# EAGLE design lanpilot (EAGLE 5.06)
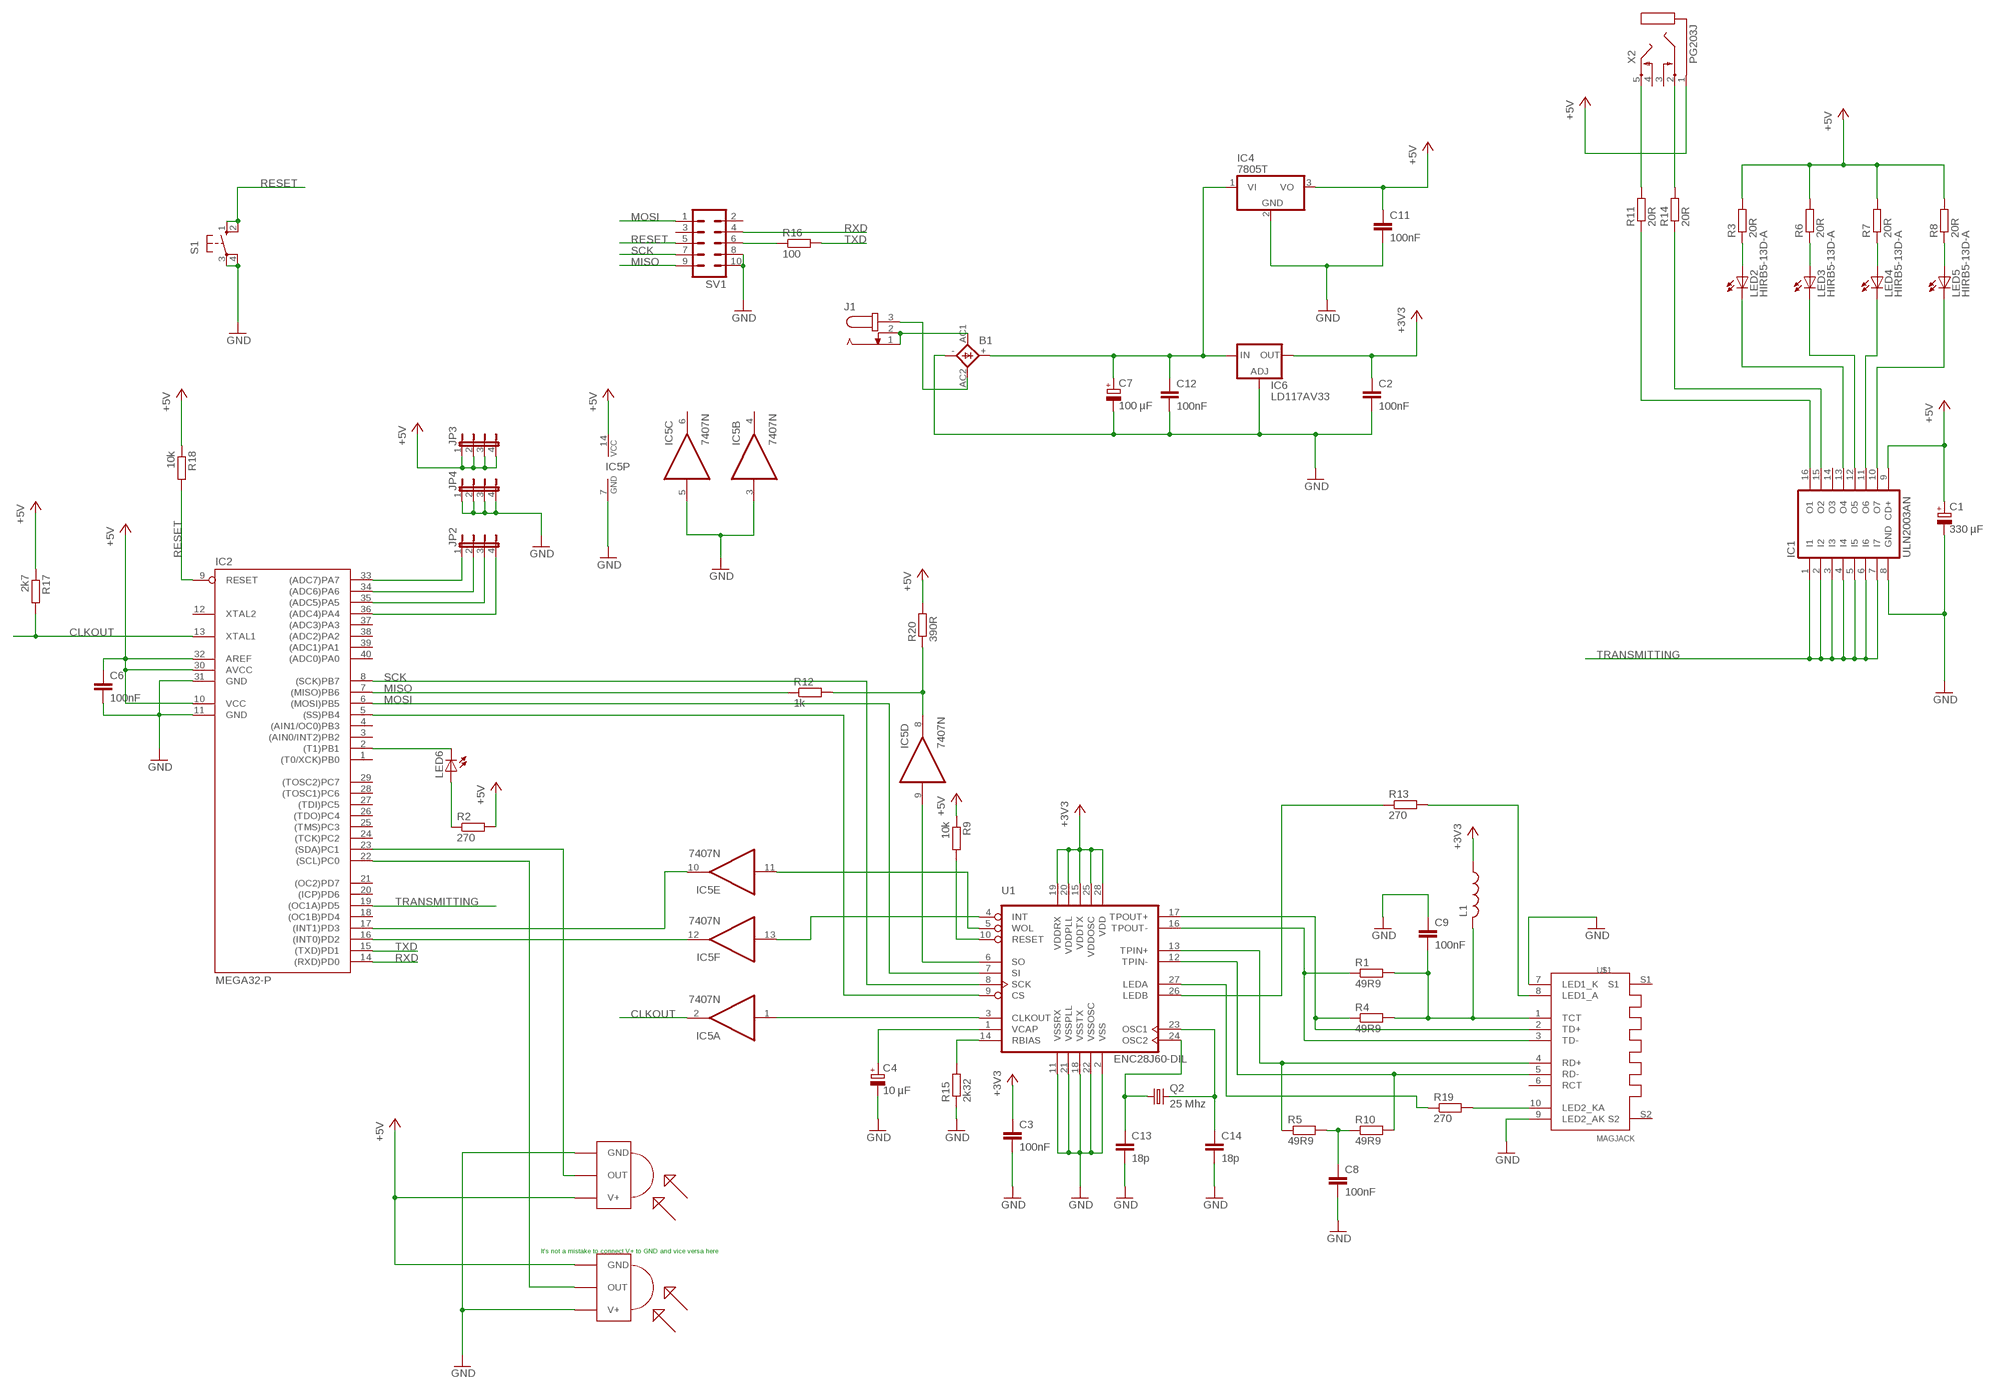
[diagram p0: schematic, sheet 1]

## Parts
B1  1KAB  [1KAB]
C1  330 µF  CPOL-EUE5-10.5  [E5-10,5]
C2  100nF  C-EU025-025X050  [C025-025X050]
C3  100nF  C-EU025-025X050  [C025-025X050]
C4  10 µF  CPOL-EUE5-5  [E5-5]
C6  100nF  C-EU025-025X050  [C025-025X050]
C7  100 µF  CPOL-EUE5-10.5  [E5-10,5]
C8  100nF  C-EU025-025X050  [C025-025X050]
C9  100nF  C-EU025-025X050  [C025-025X050]
C11  100nF  C-EU025-025X050  [C025-025X050]
C12  100nF  C-EU025-025X050  [C025-025X050]
C13  18p  C-EU025-030X050  [C025-030X050]
C14  18p  C-EU025-030X050  [C025-030X050]
IC1  ULN2003AN  [DIL16]
IC2  MEGA32-P  [DIL40]
IC4  7805T  [TO220H]
IC5  7407N  [DIL14]
IC6  LD117AV33  [TO220L1]
J1  JACK-PLUG1  [SPC4078]
JP2  JP4E  [JP4]
JP3  JP4E  [JP4]
JP4  JP4E  [JP4]
L1  L-US0204/7  [0204/7@1]
LED2  HIRB5-13D-A  LED5MM  [LED5MM]
LED3  HIRB5-13D-A  LED5MM  [LED5MM]
LED4  HIRB5-13D-A  LED5MM  [LED5MM]
LED5  HIRB5-13D-A  LED5MM  [LED5MM]
LED6  LED5MM  [LED5MM]
Q2  25 Mhz  CRYSTALHC49U70  [HC49U70]
R1  49R9  R-EU_MELF0102W  [MINI_MELF-0102W]
R2  270  R-EU_0207/10  [0207/10]
R3  20R  R-EU_0207/10  [0207/10]
R4  49R9  R-EU_MELF0102W  [MINI_MELF-0102W]
R5  49R9  R-EU_MELF0102W  [MINI_MELF-0102W]
R6  20R  R-EU_0207/10  [0207/10]
R7  20R  R-EU_0207/10  [0207/10]
R8  20R  R-EU_0207/10  [0207/10]
R9  10k  R-EU_0207/10  [0207/10]
R10  49R9  R-EU_MELF0102W  [MINI_MELF-0102W]
R11  20R  R-EU_0207/10  [0207/10]
R12  1k  R-EU_0207/7  [0207/7]
R13  270  R-EU_0207/15  [0207/15]
R14  20R  R-EU_0207/10  [0207/10]
R15  2k32  R-EU_0207/7  [0207/7]
R16  100  R-EU_0207/10  [0207/10]
R17  2k7  R-EU_0207/10  [0207/10]
R18  10k  R-EU_0207/10  [0207/10]
R19  270  R-EU_0207/7  [0207/7]
R20  390R  R-EU_0207/15  [0207/15]
S1  10-XX  [B3F-10XX]
SV1  ML10  [ML10]
TSOP1738  TSOP1738  [TSOP17XX]
TSOP32156  TSOP4838  [TSOP18XX]
U1  ENC28J60-DIL  [DIL28-3]
U$1  MAGJACK  [08B0-1X1T-06-F]
X2  PG203J  [PG203J]

## Nets
+3V3: C2.1 C3.1 IC6.2(OUT) L1.1 U1.15(VDDTX) U1.19(VDDRX) U1.20(VDDPLL) U1.25(VDDOSC) U1.28(VDD)
+5V: C1.+ C6.1 C11.1 IC1.9(CD+) IC2.10(VCC) IC2.30(AVCC) IC2.32(AREF) IC4.3(VO) IC5.14(P:VCC) JP3.1 JP3.2 JP3.3 JP3.4 R2.2 R3.2 R6.2 R7.2 R8.2 R9.1 R17.1 R18.1 R20.2 TSOP1738.V+ TSOP32156.GND X2.1
CLKOUT: IC2.13(XTAL1) IC5.2(A:O) R17.2
GND: B1.- C1.- C2.2 C3.2 C4.- C6.2 C7.- C8.2 C9.1 C11.2 C12.2 C13.2 C14.2 IC1.8(GND) IC2.11(GND) IC2.31(GND) IC4.2(GND) IC5.3(B:I) IC5.5(C:I) IC5.7(P:GND) IC6.1(ADJ) JP4.1 JP4.2 JP4.3 JP4.4 R15.1 S1.3(P) S1.4(P1) SV1.8 SV1.10 TSOP1738.GND TSOP32156.VCC(V+) U1.2(VSS) U1.11(VSSRX) U1.18(VSSTX) U1.21(VSSPLL) U1.22(VSSOSC) U$1.7(LED1_K) U$1.9(LED2_AK)
MISO: IC2.7((MISO)PB6) R12.1 SV1.9
MOSI: IC2.6((MOSI)PB5) SV1.1 U1.7(SI)
N$1: IC2.2((T1)PB1) LED6.K(C)
N$2: C13.1 Q2.1 U1.24(OSC2)
N$3: IC2.23((SDA)PC1) TSOP1738.OUT
N$4: C8.1 R5.2 R10.1
N$5: R5.1 U1.13(TPIN+) U$1.4(RD+)
N$6: R1.1 U1.16(TPOUT-) U$1.3(TD-)
N$7: R13.1 U1.26(LEDB)
N$8: C9.2 L1.2 R1.2 R4.2 U$1.1(TCT)
N$9: R13.2 U$1.8(LED1_A)
N$10: C14.1 Q2.2 U1.23(OSC1)
N$11: R15.2 U1.14(RBIAS)
N$12: C4.+ U1.1(VCAP)
N$13: R4.1 U1.17(TPOUT+) U$1.2(TD+)
N$14: IC2.33((ADC7)PA7) JP2.1
N$15: R14.2 X2.2
N$16: IC1.16(O1) R11.1
N$17: R10.2 U1.12(TPIN-) U$1.5(RD-)
N$18: IC5.9(D:I) U1.6(SO)
N$19: R19.2 U$1.10(LED2_KA)
N$20: R16.1 SV1.6
N$21: IC5.8(D:O) R12.2 R20.1
N$22: R19.1 U1.27(LEDA)
N$23: IC1.10(O7) LED5.K(C)
N$24: LED6.A R2.1
N$25: IC1.11(O6) LED4.K(C)
N$26: IC2.22((SCL)PC0) TSOP32156.OUT
N$27: IC1.12(O5) LED3.K(C)
N$28: IC1.13(O4) LED2.K(C)
N$29: B1.+ C7.+ C12.1 IC4.1(VI) IC6.3(IN)
N$30: IC2.5((SS)PB4) U1.9(CS)
N$31: R11.2 X2.5
N$32: LED2.A R3.1
N$33: LED3.A R6.1
N$34: LED4.A R7.1
N$35: LED5.A R8.1
N$38: IC2.17((INT1)PD3) IC5.10(E:O)
N$40: R9.2 U1.10(RESET)
N$41: IC5.11(E:I) U1.5(WOL)
N$42: IC2.34((ADC6)PA6) JP2.2
N$43: IC2.35((ADC5)PA5) JP2.3
N$44: IC2.36((ADC4)PA4) JP2.4
N$45: IC2.16((INT0)PD2) IC5.12(F:O)
N$46: IC5.13(F:I) U1.4(INT)
N$48: IC5.1(A:I) U1.3(CLKOUT)
N$50: B1.AC2 J1.3
N$52: B1.AC1 J1.1 J1.2
REMOTE_OUTPUT: IC1.15(O2) R14.1
RESET: IC2.9(RESET) R18.2 S1.1(S) S1.2(S1) SV1.5
RXD: IC2.14((RXD)PD0) SV1.4
SCK: IC2.8((SCK)PB7) SV1.7 U1.8(SCK)
TRANSMITTING: IC1.1(I1) IC1.2(I2) IC1.3(I3) IC1.4(I4) IC1.5(I5) IC1.6(I6) IC1.7(I7) IC2.19((OC1A)PD5)
TXD: IC2.15((TXD)PD1) R16.2
Unconnected: IC1.14(O3) IC2.1((T0/XCK)PB0) IC2.3((AIN0/INT2)PB2) IC2.4((AIN1/OC0)PB3) IC2.12(XTAL2) IC2.18((OC1B)PD4) IC2.20((ICP)PD6) IC2.21((OC2)PD7) IC2.24((TCK)PC2) IC2.25((TMS)PC3) IC2.26((TDO)PC4) IC2.27((TDI)PC5) IC2.28((TOSC1)PC6) IC2.29((TOSC2)PC7) IC2.37((ADC3)PA3) IC2.38((ADC2)PA2) IC2.39((ADC1)PA1) IC2.40((ADC0)PA0) IC5.4(B:O) IC5.6(C:O) SV1.2 SV1.3 U$1.6(RCT) U$1.S1 U$1.S2 X2.3 X2.4

## Notes on the sheet
- It's not a mistake to connect V+ to GND and vice versa here

## Library data of the parts
B1 = rectifier:1KAB: RECTIFIER grid 5,08 x 5,08 mm
C1 C4 C7 = rcl:CPOL-EU: POLARIZED CAPACITOR, European symbol
C2 C3 C6 C8 C9 C11-C14 = rcl:C-EU: CAPACITOR, European symbol
IC1 = uln-udn:ULN2003A: DRIVER ARRAY
IC2 = atmel:MEGA32-P: MICROCONTROLLER 32 Kbytes FLASH 2 Kbytes SRAM 1 Kbytes EEPROM USART 8-channel 10 bit ADC Source: www.atmel.com .. doc2503.pdf
IC4 = linear:78*: Positive VOLTAGE REGULATOR Source: http://cache.national.com/ds/LM/LM78L05.pdf http://www.fairchildsemi.com/ds/LM/LM7805.pdf
IC5 = 74xx-eu:74*07: Hex BUFFER, open collector high-voltage output
IC6 = v-reg:LD117A?*: Low drop fixed and adjustable positive voltage regulators 1 A Source: http://www.st.com/stonline/products/literature/ds/7194/ld1117axx.pdf
J1 = con-jack:JACK-PLUG: DC POWER JACK Power Jack, DC, Right Angle, Through Hole, Rated 5A at 16VDC, PC Terminals Distributor: Farnell (www.Farnell.de) Drawing: 84N1161.pdf / 84N1162.pdf Manufacturer: SPC Technology (www.spctechnology.com) Type: SPC4077 / SPC 4078
JP2-JP4 = jumper:JP4E: JUMPER
L1 = rcl:L-US: INDUCTOR, American symbol
LED2-LED6 = led:LED: LED OSRAM: - CHIPLED LG R971, LG N971, LY N971, LG Q971, LY Q971, LO R971, LY R971 LH N974, LH R974 LS Q976, LO Q976, LY Q976 LO Q996 - Hyper CHIPLED LW Q18S LB Q993, LB Q99A, LB R99A - SideLED LS A670, LO A670, LY A670, LG A670, LP A670 LB A673, LV A673, LT A673, LW A673 LH A674 LY A675 LS A676, LA A676, LO A676, LY A676, LW A676 LS A679, LY A679, LG A679 - Hyper Micro SIDELED® LS Y876, LA Y876, LO Y876, LY Y876 LT Y87S - SmartLED LW L88C, LW L88S LB L89C, LB L89S, LG L890 LS L89K, LO L89K, LY L89K LS L896, LA L896, LO L896, LY L896 - TOPLED LS T670, LO T670, LY T670, LG T670, LP T670 LSG T670, LSP T670, LSY T670, LOP T670, LYG T670 LG T671, LOG T671, LSG T671 LB T673, LV T673, LT T673, LW T673 LH T674 LS T676, LA T676, LO T676, LY T676, LB T676, LH T676, LSB T676, LW T676 LB T67C, LV T67C, LT T67C, LS T67K, LO T67K, LY T67K, LW E67C LS E67B, LA E67B, LO E67B, LY E67B, LB E67C, LV E67C, LT E67C LW T67C LS T679, LY T679, LG T679 LS T770, LO T770, LY T770, LG T770, LP T770 LB T773, LV T773, LT T773, LW T773 LH T774 LS E675, LA E675, LY E675, LS T675 LS T776, LA T776, LO T776, LY T776, LB T776 LHGB T686 LT T68C, LB T68C - Hyper Mini TOPLED® LB M676 - Mini TOPLED Santana® LG M470 LS M47K, LO M47K, LY M47K Source: http://www.osram.convergy.de LUXEON: - LUMILED® LXK2-PW12-R00, LXK2-PW12-S00, LXK2-PW14-U00, LXK2-PW14-V00 LXK2-PM12-R00, LXK2-PM12-S00, LXK2-PM14-U00 LXK2-PE12-Q00, LXK2-PE12-R00, LXK2-PE12-S00, LXK2-PE14-T00, LXK2-PE14-U00 LXK2-PB12-K00, LXK2-PB12-L00, LXK2-PB12-M00, LXK2-PB14-N00, LXK2-PB14-P00, LXK2-PB14-Q00 LXK2-PR12-L00, LXK2-PR12-M00, LXK2-PR14-Q00, LXK2-PR14-R00 LXK2-PD12-Q00, LXK2-PD12-R00, LXK2-PD12-S00 LXK2-PH12-R00, LXK2-PH12-S00 LXK2-PL12-P00, LXK2-PL12-Q00, LXK2-PL12-R00 Source: www.luxeon.com KINGBRIGHT: KA-3528ASYC Source: www.kingbright.com
Q2 = crystal:CRYSTAL: CRYSTAL
R1-R20 = rcl:R-EU_: RESISTOR, European symbol
S1 = switch-omron:10-XX: OMRON SWITCH
SV1 = con-harting-ml:ML10: HARTING
TSOP1738 = tsop:TSOP1738: IR Receiver and Demodulator
TSOP32156 = tsop:TSOP4838: IR Receiver and Demodulator
U1 = enc28j60:ENC28J60-*: Microchip 10Mbit Ethernet controller with SPI interface Improved SOIC28 layout (pads in 0.01 raster, pin1 slightly smaller). Pin 6 (SO) changed from Out (paralleling several Outs gives an error) to OC. Author: Profi from mikrocontroller.net - forum Date: 2006.0827
U$1 = magjack-2-freeware:MAGJACK: Magjack RJ45: 08B0-1X1T-06-F mcgregor@blackmesaeast.com.pl
X2 = con-hirschmann:PG203J: MIC/HEADPHONE JACK KS-S stereo microphone/headphone jack PG203JN (Schukat)

## Board
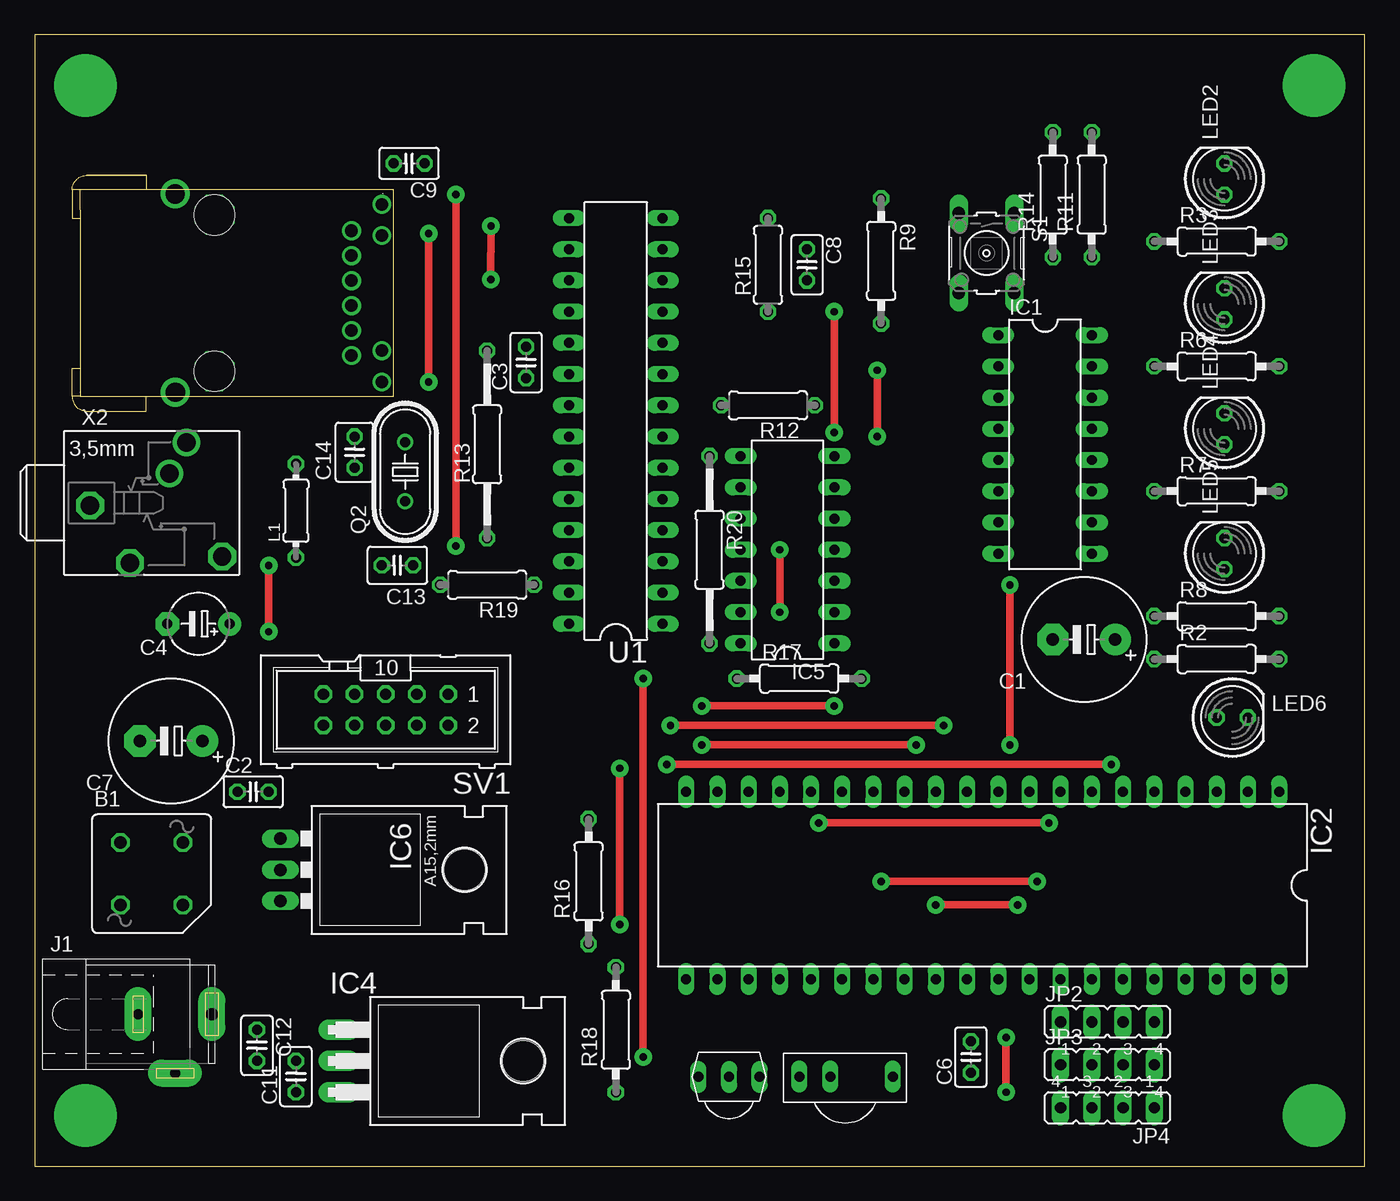
[diagram p1: board, top side]
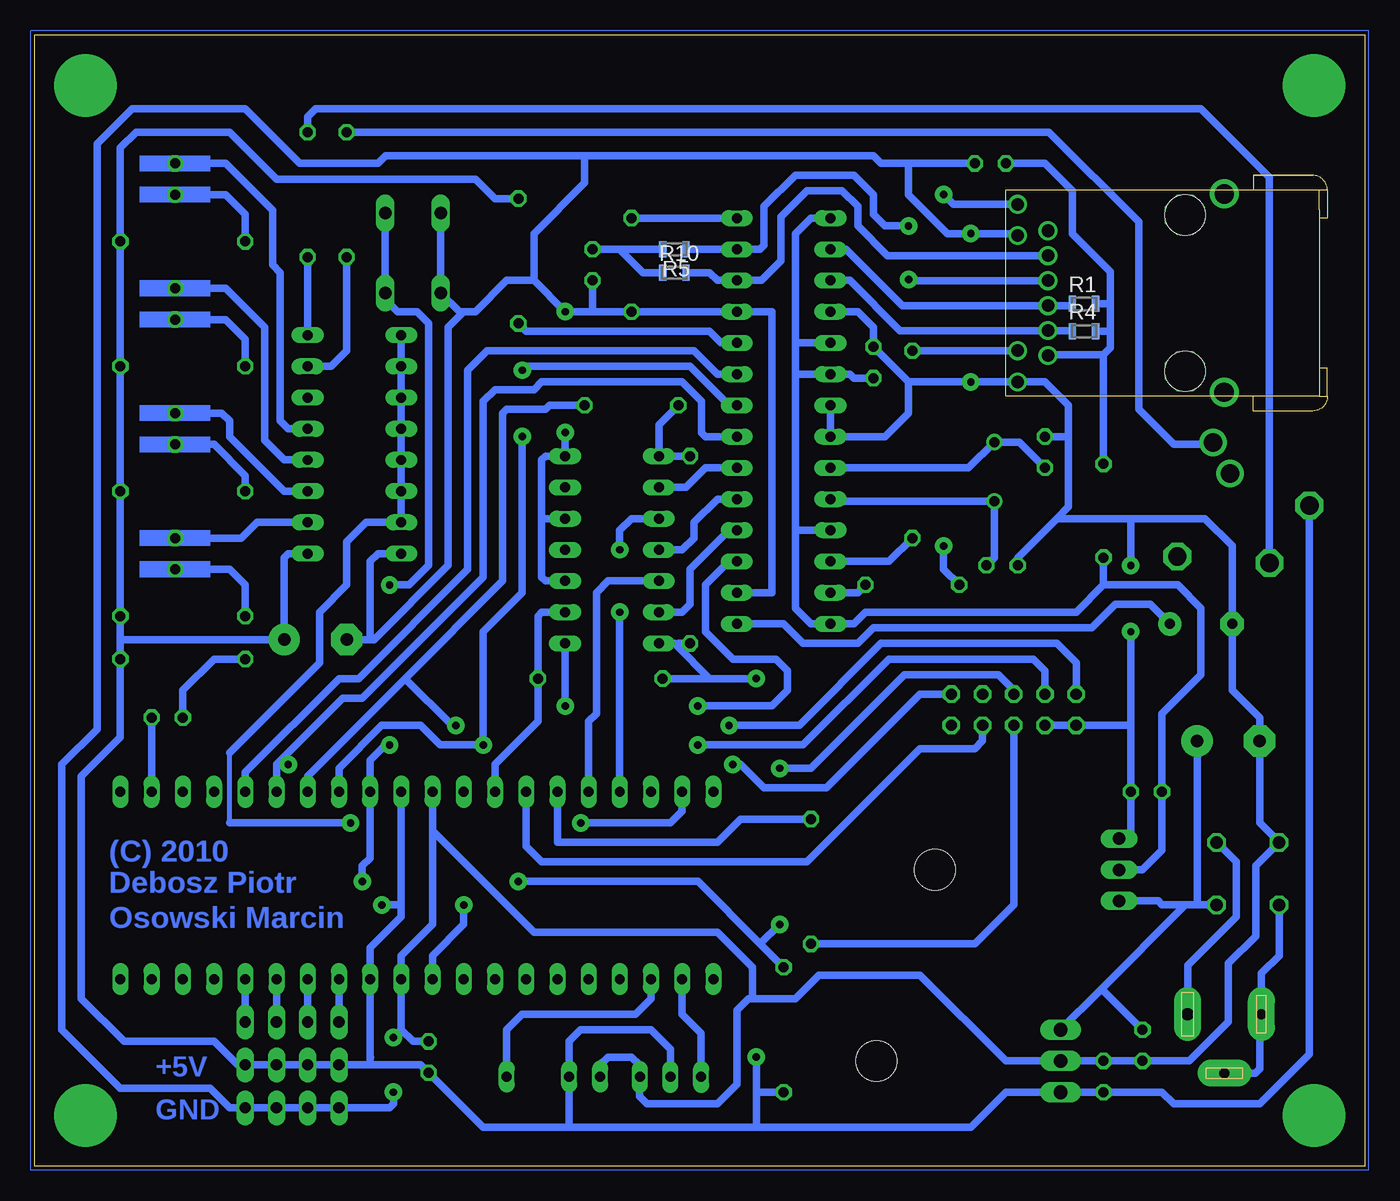
[diagram p2: board, bottom side, seen from below]

Size 108.25 x 92.06 mm. Coordinates in mm from the lower left corner, seen from the top.
Outline: 0,0 108.25,0 108.25,92.07 0,92.07 0,0
Copper layers (1*16): Top 0.035mm / dielectric 1.5mm / Bottom 0.035mm
Design rules "default *": minimum track width 10mil, minimum drill 12mil, track to track 8mil, track to pad 8mil, pad to pad 8mil, via to via 8mil, smd to smd 8mil, copper to edge 40mil, drill to drill 8mil, minimum pad ring 10mil, minimum via ring 8mil, stop-mask expansion 4mil, vias tented up to drill 0mil, thermal gap 10mil

### Footprints (pad centres in the part's own frame; a part is rotated, then mirrored left to right if it is on the bottom)
1KAB = drill 1.016 octagon: + 2.54,-2.54; - -2.54,2.54; AC1 -2.54,-2.54; AC2 2.54,2.54
E5-10,5 = drill 1.016 pad 2.54 round: + -2.54,0 | drill 1.016 pad 2.54 octagon: - 2.54,0
C025-025X050 = drill 0.813 octagon: 1 -1.27,0; 2 1.27,0
E5-5 = drill 0.813 pad 1.905 round: + -2.54,0 | drill 0.813 pad 1.905 octagon: - 2.54,0
C025-030X050 = drill 0.813 octagon: 1 -1.27,0; 2 1.27,0
DIL16 = drill 0.813 long: 1 -8.89,-3.81; 2 -6.35,-3.81; 3 -3.81,-3.81; 4 -1.27,-3.81; 5 1.27,-3.81; 6 3.81,-3.81; 7 6.35,-3.81; 8 8.89,-3.81; 9 8.89,3.81; 10 6.35,3.81; 11 3.81,3.81; 12 1.27,3.81; 13 -1.27,3.81; 14 -3.81,3.81; 15 -6.35,3.81; 16 -8.89,3.81
DIL40 = drill 0.813 long: 1 -24.13,-7.62; 2 -21.59,-7.62; 3 -19.05,-7.62; 4 -16.51,-7.62; 5 -13.97,-7.62; 6 -11.43,-7.62; 7 -8.89,-7.62; 8 -6.35,-7.62; 9 -3.81,-7.62; 10 -1.27,-7.62; 11 1.27,-7.62; 12 3.81,-7.62; 13 6.35,-7.62; 14 8.89,-7.62; 15 11.43,-7.62; 16 13.97,-7.62; 17 16.51,-7.62; 18 19.05,-7.62; 19 21.59,-7.62; 20 24.13,-7.62; 21 24.13,7.62; 22 21.59,7.62; 23 19.05,7.62; 24 16.51,7.62; 25 13.97,7.62; 26 11.43,7.62; 27 8.89,7.62; 28 6.35,7.62; 29 3.81,7.62; 30 1.27,7.62; 31 -1.27,7.62; 32 -3.81,7.62; 33 -6.35,7.62; 34 -8.89,7.62; 35 -11.43,7.62; 36 -13.97,7.62; 37 -16.51,7.62; 38 -19.05,7.62; 39 -21.59,7.62; 40 -24.13,7.62
TO220H = drill 1.118 long: 1 -2.54,-10.16; 2 0,-10.16; 3 2.54,-10.16 | hole 3.302: 0,4.826
DIL14 = drill 0.813 long: 1 -7.62,-3.81; 2 -5.08,-3.81; 3 -2.54,-3.81; 4 0,-3.81; 5 2.54,-3.81; 6 5.08,-3.81; 7 7.62,-3.81; 8 7.62,3.81; 9 5.08,3.81; 10 2.54,3.81; 11 0,3.81; 12 -2.54,3.81; 13 -5.08,3.81; 14 -7.62,3.81
TO220L1 = drill 1.016 long: 1 -2.54,-3.81; 2 0,-3.81; 3 2.54,-3.81 | hole 3.302: 0,11.176
SPC4078 = drill 0.8 pad 2.184 long: 1 -3,0; 2 0,-4.8 | drill 1 pad 2.184 long: 3 3,0
JP4 = drill 0.914 long: 1 -3.81,0; 2 -1.27,0; 3 1.27,0; 4 3.81,0
0204/7@1 = drill 0.813 octagon: 1 -3.81,0; 2 3.81,0
LED5MM = drill 0.813 octagon: A -1.27,0; K 1.27,0
HC49U70 = drill 0.813 round: 1 -2.413,0; 2 2.413,0
MINI_MELF-0102W = smd 0.6 x 1.3: 1 -0.95,0; 2 0.95,0
0207/10 = drill 0.813 octagon: 1 -5.08,0; 2 5.08,0
0207/7 = drill 0.813 octagon: 1 -3.81,0; 2 3.81,0
0207/15 = drill 0.813 octagon: 1 -7.62,0; 2 7.62,0
B3F-10XX = drill 1.016 long: 1 -3.251,2.261; 2 3.251,2.261; 3 -3.251,-2.261; 4 3.251,-2.261
ML10 = drill 0.914 octagon: 1 -5.08,-1.27; 2 -5.08,1.27; 3 -2.54,-1.27; 4 -2.54,1.27; 5 0,-1.27; 6 0,1.27; 7 2.54,-1.27; 8 2.54,1.27; 9 5.08,-1.27; 10 5.08,1.27
TSOP17XX = drill 0.813 long: GND -3.81,0; OUT 3.81,0; V+ -1.27,0
TSOP18XX = drill 0.813 long: GND -0.001,-0.027; OUT -2.501,-0.027; VCC 2.499,-0.027
DIL28-3 = drill 0.813 long: 1 -16.51,-3.81; 2 -13.97,-3.81; 3 -11.43,-3.81; 4 -8.89,-3.81; 5 -6.35,-3.81; 6 -3.81,-3.81; 7 -1.27,-3.81; 8 1.27,-3.81; 9 3.81,-3.81; 10 6.35,-3.81; 11 8.89,-3.81; 12 11.43,-3.81; 13 13.97,-3.81; 14 16.51,-3.81; 15 16.51,3.81; 16 13.97,3.81; 17 11.43,3.81; 18 8.89,3.81; 19 6.35,3.81; 20 3.81,3.81; 21 1.27,3.81; 22 -1.27,3.81; 23 -3.81,3.81; 24 -6.35,3.81; 25 -8.89,3.81; 26 -11.43,3.81; 27 -13.97,3.81; 28 -16.51,3.81
08B0-1X1T-06-F = drill 1.02 round: 1 2.15,2.46; 2 4.18,2.46; 3 6.21,2.46; 4 8.24,2.46; 5 10.27,2.46; 6 12.3,2.46; 7 0,0; 8 2.54,0; 9 11.91,0; 10 14.45,0 | drill 1.57 round: S1 -0.83,16.808; S2 15.3,16.809 | hole 3.25: 0.88,13.63; 13.58,13.63
PG203J = drill 1.499 octagon: 1 -5.004,-0.203; 4 5.74,-4.369; 5 -1.753,-4.902 | drill 1.499 round: 2 2.845,4.902; 3 1.448,2.388

### Placement (x,y rotation side)
B1  9.53,23.81 0 top
C1  85.41,42.86 180 top
C2  17.78,30.48 0 top
C3  40.01,65.41 90 top
C4  13.34,44.13 180 top
C6  76.2,8.89 90 top
C7  11.11,34.61 180 top
C8  62.87,73.34 270 top
C9  30.48,81.6 180 top
C11  21.27,7.3 90 top
C12  18.1,9.84 270 top
C13  29.53,48.89 180 top
C14  26.04,58.1 90 top
IC1  82.23,58.74 270 top
IC2  77.15,22.86 180 top
IC4  34.92,8.57 270 top
IC5  61.28,50.16 90 top
IC6  23.81,24.13 270 top
J1  11.43,12.38 0 top
JP2  87.31,11.75 0 top
JP3  87.31,8.26 0 top
JP4  87.31,4.76 180 top
L1  21.27,53.34 90 top
LED2  96.84,80.33 90 top
LED3  96.84,70.17 90 top
LED4  96.84,60.01 90 top
LED5  96.84,49.85 90 top
LED6  97.47,36.51 0 top
Q2  30.16,56.52 90 top
R1  22.86,70.17 0 bottom
R2  96.2,41.27 0 top
R3  96.2,75.25 0 top
R4  22.86,67.95 0 bottom
R5  56.2,74.61 180 bottom
R6  96.2,65.09 0 top
R7  96.2,54.93 0 top
R8  96.2,44.77 0 top
R9  68.9,73.66 270 top
R10  56.2,72.71 0 bottom
R11  86.04,79.06 90 top
R12  59.69,61.91 180 top
R13  36.83,58.74 90 top
R14  82.87,79.06 90 top
R15  59.69,73.34 90 top
R16  45.09,23.18 90 top
R17  62.23,39.69 0 top
R18  47.31,11.11 90 top
R19  36.83,47.31 180 top
R20  54.93,50.16 270 top
S1  77.47,74.3 270 top
SV1  28.57,37.15 180 top
TSOP1738  66.04,7.3 0 top
TSOP32156  56.52,7.3 0 top
U1  47.31,60.64 90 top
U$1  28.26,63.82 90 top
X2  9.53,53.97 0 top

### Tracks (layer width: path | path; a pad name or v marks a point on that pad's centre or on a via)
+3V3
  Bottom 0.61: U1.15 45.09,77.15 46.35,75.88 46.35,66.99 | 46.35,51.75 46.35,45.4 45.09,44.13 U1.28 41.59,44.13 40.64,45.09 23.5,45.09 21.27,47.31 | 46.35,51.75 46.35,64.45 | 46.35,64.45 46.35,66.99 | 46.35,51.75 U1.25 | 46.35,66.99 U1.19 | 46.35,64.45 U1.20 41.91,64.45 41.59,64.14 C3.1 | IC6.2 18.1,24.13 16.51,25.72 C2.1 16.51,36.83 13.34,40 13.34,45.4 15.24,47.31 21.27,47.31 | 21.27,47.31 L1.1
+5V  (via drill 0.6 pad 1.42)
  Top 0.61: v49.53,8.89 v49.53,39.69 | v80.01,21.27 v73.34,21.27
  Bottom 0.61: 101.28,42.86 C1.+ 87.95,49.53 87.63,49.85 IC1.9 | 101.28,42.86 R8.2 R7.2 R6.2 R3.2 101.28,82.87 100.01,84.14 92.39,84.14 88.58,80.33 72.39,80.33 70.8,78.74 R9.1 | 78.42,21.27 78.42,20.32 80.96,17.78 IC2.32 80.96,8.89 | 78.42,21.27 IC2.10 | IC2.30 75.88,17.15 73.34,19.68 v73.34,21.27 | 78.42,21.27 v80.01,21.27 | 101.28,42.86 R2.2 | 101.28,42.86 101.28,34.92 103.19,33.02 | 103.19,33.02 103.5,32.7 | v49.53,39.69 53.34,39.69 | 53.34,39.69 R17.1 | 80.96,8.89 80.94,8.86 | 103.19,33.02 104.46,31.75 104.46,13.65 100.97,10.16 93.66,10.16 91.76,8.26 JP3.4 JP3.3 JP3.2 JP3.1 80.96,8.26 | X2.1 4.52,9.13 8.57,5.08 15.56,5.08 16.51,6.03 C11.1 IC4.3 29.21,6.03 32.07,3.17 49.53,3.17 | 49.53,6.03 R18.1 | 49.53,6.03 v49.53,8.89 | 49.53,3.17 64.77,3.17 | 64.77,3.17 TSOP1738.V+ 64.77,10.16 63.82,11.11 58.1,11.11 56.51,9.52 TSOP32156.GND | 64.77,3.17 71.75,3.17 C6.1 76.84,8.26 80.96,8.26 | 80.96,8.26 80.96,8.89 | 49.53,3.17 49.53,6.03 | IC5.14 56.2,42.54 56.04,42.39 | 53.34,39.69 56.04,42.39 | R20.2 55.88,42.54 56.04,42.39
CLKOUT
  Bottom 0.61: IC2.13 70.8,32.7 67.31,36.2 R17.2 67.31,44.77 66.99,45.09 IC5.2
GND  (via drill 0.6 pad 1.42)
  Top 0.61: v79.06,10.48 v79.06,6.03 | v65.09,69.53 v65.09,59.69 | v32.07,63.82 v32.07,75.88 | v19.05,48.89 v19.05,43.5
  Bottom 0.61: U1.2 48.26,46.67 48.26,69.53 U1.11 R15.1 62.87,69.53 | v65.09,59.69 IC5.7 66.67,57.78 66.99,57.47 66.99,52.71 | 66.99,52.71 66.99,47.94 66.67,47.63 IC5.3 | 66.99,52.71 IC5.5 | 24.13,59.37 24.13,53.66 25.08,52.71 | 24.13,59.37 C14.2 | 37.15,81.6 39.37,81.6 40.01,82.23 63.5,82.23 | 24.13,59.37 24.13,61.91 26.04,63.82 U$1.7 v32.07,63.82 37.15,63.82 | U1.21 U1.22 39.05,59.37 37.15,61.28 37.15,63.82 | 63.5,82.23 79.69,82.23 80.33,81.6 86.68,81.6 91.12,86.04 100.33,86.04 103.19,83.19 103.19,35.56 106.04,32.7 106.04,11.11 101.28,6.35 93.98,6.35 92.39,4.76 JP4.1 JP4.2 JP4.3 JP4.4 79.38,4.76 79.06,5.08 v79.06,6.03 | S1.3 S1.4 73.7,69.53 73.34,69.53 | 80.96,42.86 80.65,42.86 74.61,48.89 74.61,68.26 73.34,69.53 | 80.96,42.86 C1.- | 62.87,69.53 v65.09,69.53 67.63,72.07 | IC1.8 80.33,49.85 80.96,49.21 80.96,42.86 | 67.63,72.07 69.85,72.07 72.39,69.53 73.34,69.53 | 67.63,72.07 67.63,75.88 63.5,80.01 63.5,82.23 | U$1.9 28.41,75.88 v32.07,75.88 33.97,75.88 37.15,79.06 37.15,81.6 | C13.2 28.26,49.53 25.08,52.71 | 37.15,63.82 C3.2 40.01,68.26 41.27,69.53 U1.18 | 62.87,69.53 C8.2 | SV1.8 SV1.10 19.05,35.88 | 49.85,13.65 46.35,13.65 44.45,15.56 36.2,15.56 29.21,8.57 IC4.2 C11.2 C12.2 14.29,8.57 11.11,11.75 11.11,16.51 8.89,18.73 8.89,24.45 B1.- 8.57,27.94 C7.- 8.57,36.51 10.79,38.74 C4.- 10.79,50.48 13.02,52.71 19.05,52.71 | 49.85,13.65 50.16,13.65 51.12,12.7 51.12,6.67 52.7,5.08 58.42,5.08 59.05,5.71 59.05,7.23 | 19.05,52.71 25.08,52.71 | 19.05,52.71 v19.05,48.89 | 37.15,81.6 C9.1 | v19.05,43.5 19.05,35.88 | 19.05,35.88 C2.2 19.05,26.67 IC6.1 | 75.88,27.3 IC2.11 | 49.85,13.65 49.85,16.19 52.7,19.05 67.63,19.05 75.88,27.3
  Bottom 0.61: 75.88,27.3 75.88,19.68 78.42,17.15 IC2.31 78.42,11.11 | 78.42,11.11 v79.06,10.48 | C6.2 77.47,10.16 78.42,11.11 | 59.05,7.23 TSOP32156.VCC | 59.05,7.23 59.05,8.26 59.69,8.89 61.59,8.89 62.23,8.26 TSOP1738.GND
MISO  (via drill 0.6 pad 1.42)
  Top 0.61: v51.75,35.88 v73.98,35.88
  Bottom 0.61: SV1.9 23.5,40.96 25.08,42.54 39.37,42.54 46.04,35.88 v51.75,35.88 | IC2.7 86.04,31.75 78.1,39.69 | 78.1,39.69 70.17,47.63 70.17,61.28 69.85,61.6 66.67,61.6 66.36,61.91 R12.1 | v73.98,35.88 74.29,35.88 78.1,39.69
MOSI  (via drill 0.6 pad 1.42)
  Top 0.61: v51.44,32.7 v87.63,32.7
  Bottom 0.61: v51.44,32.7 50.8,32.7 48.9,30.8 43.81,30.8 36.2,38.42 SV1.1 | U1.7 53.66,59.37 53.98,59.69 53.98,62.23 55.56,63.82 66.99,63.82 67.63,63.18 70.8,63.18 71.75,62.23 71.75,47.94 81.6,38.1 83.19,38.1 88.11,33.18 | IC2.6 88.58,32.7 88.11,33.18 | v87.63,32.7 | v87.63,32.7 88.11,33.18
N$1
  Bottom 0.61: IC2.2 LED6.K
N$2
  Bottom 0.61: U1.24 43.31,54.1 Q2.1 30.16,49.53 C13.1
N$3
  Bottom 0.61: IC2.23 58.1,13.65 59.37,12.38 68.58,12.38 69.85,11.11 TSOP1738.OUT
N$4
  Bottom 0.61: 60.64,74.61 R5.2 | 60.64,74.61 C8.1 | R10.1 58.74,72.71 60.64,74.61
N$5  (via drill 0.6 pad 1.42)
  Top 0.61: v37.12,72.17 v37.15,76.52
  Bottom 0.61: v37.15,76.52 39.05,76.52 40.01,77.47 40.01,79.06 41.59,80.64 46.35,80.64 48.9,78.11 48.9,74.93 49.21,74.61 U1.13 R5.1 | U$1.4 36.5,72.06 36.51,72.07 37.02,72.07 v37.12,72.17
N$6
  Bottom 0.61: U1.16 42.23,74.61 37.64,70.03 U$1.3 23.95,70.03 R1.1
N$7
  Bottom 0.61: U1.26 38.73,49.21 R13.1
N$8
  Bottom 0.61: R4.2 20.71,67.95 | 20.71,70.17 20.71,72.78 23.81,75.88 23.81,79.38 26.04,81.6 C9.2 | 20.71,67.95 20.71,66.6 21.27,66.04 | 20.71,67.95 20.71,70.17 | 21.27,66.04 25.73,66.04 U$1.1 | L1.2 21.27,66.04 | 20.71,70.17 R1.2
N$9
  Bottom 0.61: U$1.8 R13.2
N$10
  Bottom 0.61: U1.23 32.26,56.83 Q2.2 28.13,58.93 C14.1
N$11
  Bottom 0.61: U1.14 R15.2
N$12
  Bottom 0.61: U1.1 47.31,44.13 45.72,42.54 41.27,42.54 40.01,43.82 22.23,43.82 20.32,45.72 17.46,45.72 C4.+
N$13
  Bottom 0.61: U1.17 41.91,72.07 37.84,68 U$1.2 23.86,68 R4.1
N$14
  Bottom 0.61: JP2.1 IC2.33
N$15
  Bottom 0.61: R14.2 25.72,84.14 18.41,76.83 18.41,61.6 15.56,58.74 12.51,58.74 X2.2
N$16
  Bottom 0.61: IC1.16 R11.1
N$17
  Bottom 0.61: U$1.5 38.84,74.09 41.27,76.52 41.27,78.11 42.55,79.38 45.4,79.38 47.53,77.25 47.53,73.66 49.12,72.07 U1.12 52.7,72.07 53.34,72.71 R10.2
N$18
  Bottom 0.61: U1.6 53.66,56.83 55.24,55.24 IC5.9
N$19  (via drill 0.6 pad 1.42)
  Top 0.61: v34.29,50.48 v34.29,79.06
  Bottom 0.61: v34.29,50.48 34.29,48.58 R19.2 | v34.29,79.06 33.5,78.27 U$1.10
N$20
  Bottom 0.61: R16.1 31.75,18.1 28.57,21.27 SV1.6
N$21
  Bottom 0.61: R12.2 57.47,60.32 IC5.8 R20.1
N$22
  Bottom 0.61: U1.27 41.27,46.67 R19.1
N$23
  Bottom 0.61: LED5.K 91.44,51.12 90.17,52.39 IC1.10
N$24
  Bottom 0.61: R2.1 93.66,41.28 96.2,38.74 LED6.A
N$25
  Bottom 0.61: IC1.11 87.95,54.93 92.39,59.37 92.39,60.64 93.03,61.28 LED4.K
N$26
  Bottom 0.61: TSOP32156.OUT 54.01,10.83 55.56,12.38 IC2.22
N$27
  Bottom 0.61: LED3.K 92.71,71.44 89.53,68.26 89.53,59.06 87.95,57.47 IC1.12
N$28
  Bottom 0.61: LED2.K 92.71,81.6 88.9,77.79 88.9,73.34 88.26,72.71 88.26,60.64 87.63,60.01 IC1.13
N$29
  Bottom 0.61: 21.59,14.29 14.61,21.27 | 21.59,14.29 IC4.1 | 14.61,21.27 13.65,21.27 | 13.65,21.27 B1.+ | C12.1 21.27,14.29 21.59,14.29 | 14.61,21.27 16.51,21.27 16.83,21.59 IC6.3 | 13.65,21.27 C7.+
N$30
  Bottom 0.61: U1.9 52.7,64.45 54.61,66.36 71.44,66.36 73.03,64.77 73.03,48.58 81.91,39.69 83.5,39.69 91.12,32.07 IC2.5
N$31
  Bottom 0.61: X2.5 7.77,80.48 13.34,86.04 85.41,86.04 86.04,85.41 R11.2
N$32
  Bottom 0.61: LED2.A 92.71,79.06 91.12,77.47 R3.1
N$33
  Bottom 0.61: LED3.A 92.71,68.9 91.12,67.31 R6.1
N$34
  Bottom 0.61: LED4.A 93.66,58.74 91.12,56.2 R7.1
N$35
  Bottom 0.61: LED5.A 92.39,48.58 91.12,47.31 R8.1
N$36  (via drill 0 pad 5.08)
  other vias: 4.13,87.95
N$37  (via drill 0 pad 5.08)
  other vias: 104.14,87.95
N$38  (via drill 0.6 pad 1.42)
  Top 0.61: v60.64,45.09 v60.64,50.17
  Bottom 0.61: v60.64,50.17 60.64,51.75 59.69,52.71 IC5.10 | IC2.17 v60.64,45.09
N$39  (via drill 0 pad 5.08)
  other vias: 104.14,4.13
N$40
  Bottom 0.61: U1.10 52.39,66.99 53.34,67.95 68.26,67.95 R9.2
N$41
  Bottom 0.61: U1.5 52.7,54.29 54.61,52.39 54.61,51.12 55.56,50.17 IC5.11
N$42
  Bottom 0.61: JP2.2 IC2.34
N$43
  Bottom 0.61: JP2.3 IC2.35
N$44
  Bottom 0.61: JP2.4 IC2.36
N$45
  Bottom 0.61: IC2.16 63.18,36.2 62.55,36.83 62.55,46.67 61.59,47.63 IC5.12
N$46
  Bottom 0.61: U1.4 51.75,51.75 54.93,48.58 54.93,45.72 55.56,45.09 IC5.13
N$47  (via drill 0 pad 5.08)
  other vias: 4.13,4.13
N$48  (via drill 0.6 pad 1.42)
  Top 0.61: v54.29,37.46 v65.09,37.46
  Bottom 0.61: v65.09,37.46 IC5.1 | U1.3 51.75,49.21 53.66,47.31 53.66,43.5 51.44,41.28 47.94,41.28 46.99,40.32 46.99,38.74 48.26,37.46 v54.29,37.46
N$49
  Bottom 0: -0.32,92.39 108.59,92.39 108.59,-0.32 -0.32,-0.32 -0.32,92.39
N$50
  Bottom 0.61: J1.3 14.43,16.37 10.48,20.32 10.48,24.76 B1.AC2
N$52
  Bottom 0.61: J1.2 8.93,7.58 8.57,7.94 8.57,12.24 J1.1 8.43,15.7 6.99,17.15 B1.AC1
REMOTE_OUTPUT
  Bottom 0.61: R14.1 82.87,66.36 84.14,65.09 IC1.15
RESET  (via drill 0.6 pad 1.42)
  Top 0.61: v68.9,23.18 v81.6,23.18 | v47.62,19.68 v47.62,32.39 | v79.38,34.29 v79.38,47.31
  Bottom 0.61: SV1.5 28.57,38.74 29.84,40 37.47,40 45.09,32.39 v47.62,32.39 | S1.1 S1.2 79.73,70.52 78.74,69.53 77.15,69.53 76.2,68.58 76.2,48.89 77.79,47.31 v79.38,47.31 | v79.38,34.29 79.69,34.29 80.96,33.02 IC2.9 80.96,25.08 81.6,24.45 v81.6,23.18 | R18.2 49.21,18.1 | 49.21,18.1 54.29,23.18 v68.9,23.18 | 49.21,18.1 v47.62,19.68
RXD
  Bottom 0.61: IC2.14 68.26,26.03 66.99,24.76 45.4,24.76 36.2,33.97 31.75,33.97 31.12,34.61 SV1.4
S$1  (via drill 0.9 pad 3.25)
  other vias: 14.64,77.41
S$2  (via drill 0.9 pad 3.25)
  other vias: 14.64,64.71
SCK  (via drill 0.6 pad 1.42)
  Top 0.61: v68.58,59.37 v68.58,64.77 | v54.29,34.29 v71.75,34.29
  Bottom 0.61: SV1.7 26.04,40.32 26.99,41.28 38.73,41.28 45.72,34.29 v54.29,34.29 | v71.75,34.29 | U1.8 51.75,61.91 54.93,65.09 68.26,65.09 v68.58,64.77 | v71.75,34.29 75.25,34.29 76.84,35.88 80.01,35.88 83.5,32.39 IC2.8 | v68.58,59.37 68.58,46.67 71.75,43.5 v71.75,34.29
TRANSMITTING  (via drill 0.6 pad 1.42)
  Top 0.61: v63.82,27.94 v82.55,27.94
  Bottom 0.406: 92.39,27.94 92.39,33.65
  Bottom 0.61: IC1.1 IC1.2 IC1.3 IC1.4 IC1.5 IC1.6 IC1.7 81.28,52.39 82.87,50.8 82.87,47.31 85.09,45.09 85.09,40.96 92.39,33.65 | IC2.19 55.56,28.89 56.52,27.94 v63.82,27.94 | v82.55,27.94 92.39,27.94
TXD
  Bottom 0.61: IC2.15 65.72,26.35 52.7,26.35 50.8,28.26 R16.2
(copper drawn outside any net)
  shapes: Bottom area x8

### Text on the board
Bottom: (C) 2010 | Debosz Piotr | Osowski Marcin | +5V | GND